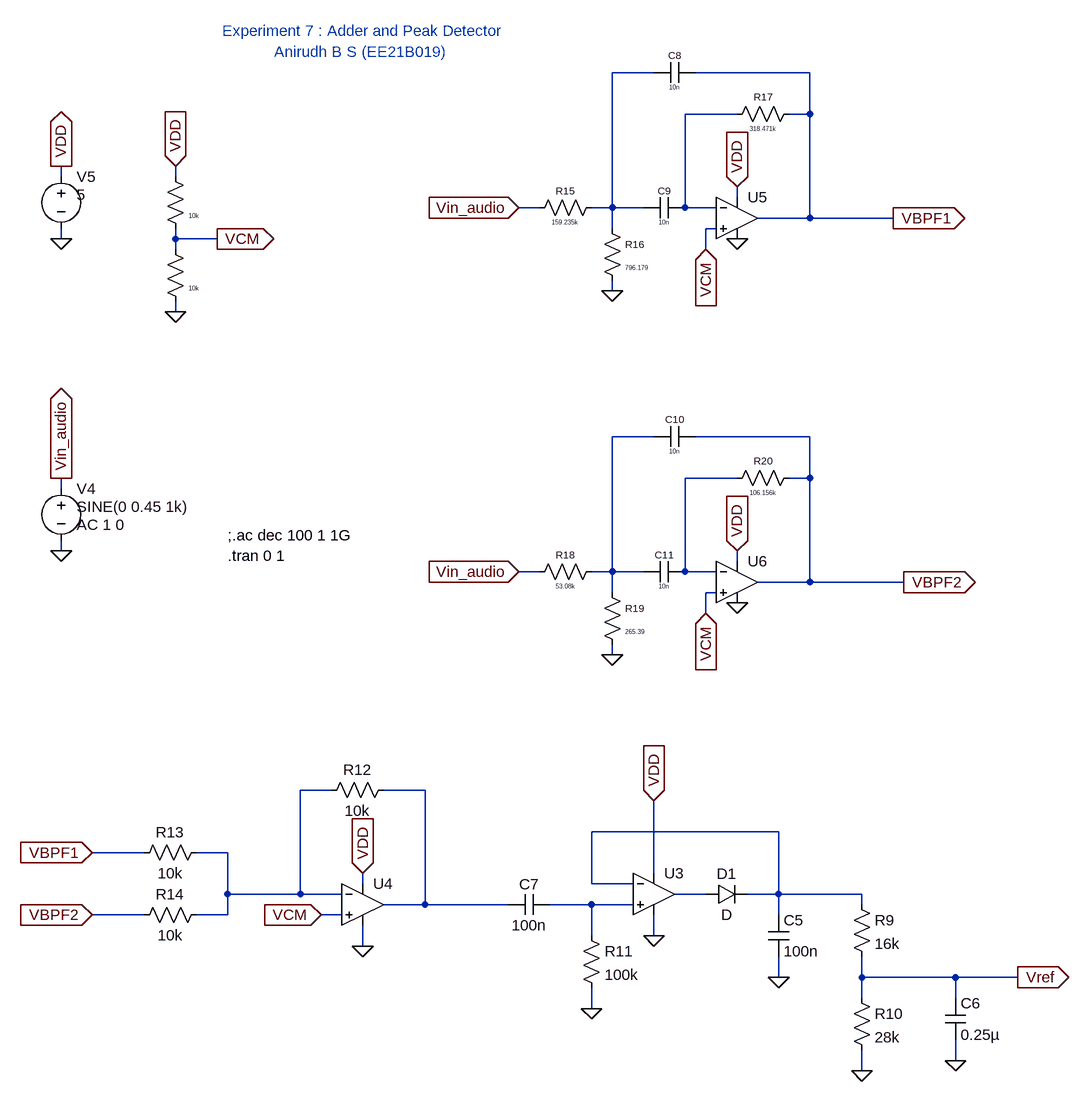
[diagram p0: schematic Experiment 7.asc]
Experiment 7.asc, the LTspice schematic file:
Version 4
SHEET 1 4812 1308
WIRE 4144 -576 4080 -576
WIRE 4384 -576 4208 -576
WIRE 4272 -512 4192 -512
WIRE 4384 -512 4384 -576
WIRE 4384 -512 4352 -512
WIRE 3232 -416 3232 -432
WIRE 3408 -416 3408 -432
WIRE 4272 -384 4272 -400
WIRE 3968 -368 3936 -368
WIRE 4080 -368 4080 -576
WIRE 4080 -368 4048 -368
WIRE 4128 -368 4080 -368
WIRE 4192 -368 4192 -512
WIRE 4240 -368 4192 -368
WIRE 4384 -352 4384 -512
WIRE 4384 -352 4304 -352
WIRE 4512 -352 4384 -352
WIRE 4080 -336 4080 -368
WIRE 4240 -336 4224 -336
WIRE 3232 -320 3232 -336
WIRE 3408 -320 3408 -336
WIRE 3472 -320 3408 -320
WIRE 3408 -304 3408 -320
WIRE 4224 -304 4224 -336
WIRE 4080 -240 4080 -256
WIRE 3408 -208 3408 -224
WIRE 4144 -16 4080 -16
WIRE 4384 -16 4208 -16
WIRE 4272 48 4192 48
WIRE 4384 48 4384 -16
WIRE 4384 48 4352 48
WIRE 3232 64 3232 48
WIRE 3232 160 3232 144
WIRE 4272 176 4272 160
WIRE 3968 192 3936 192
WIRE 4080 192 4080 -16
WIRE 4080 192 4048 192
WIRE 4128 192 4080 192
WIRE 4192 192 4192 48
WIRE 4240 192 4192 192
WIRE 4384 208 4384 48
WIRE 4384 208 4304 208
WIRE 4528 208 4384 208
WIRE 4080 224 4080 192
WIRE 4240 224 4224 224
WIRE 4224 256 4224 224
WIRE 4080 320 4080 304
WIRE 3648 528 3600 528
WIRE 3792 528 3728 528
WIRE 4336 592 4048 592
WIRE 3360 624 3280 624
WIRE 3488 624 3440 624
WIRE 4144 656 4144 544
WIRE 3696 672 3696 656
WIRE 4048 672 4048 592
WIRE 4112 672 4048 672
WIRE 3488 688 3488 624
WIRE 3600 688 3600 528
WIRE 3600 688 3488 688
WIRE 3664 688 3600 688
WIRE 4224 688 4176 688
WIRE 4336 688 4336 592
WIRE 4336 688 4288 688
WIRE 4464 688 4336 688
WIRE 3792 704 3792 528
WIRE 3792 704 3728 704
WIRE 3920 704 3792 704
WIRE 4048 704 3984 704
WIRE 4112 704 4048 704
WIRE 4464 704 4464 688
WIRE 3360 720 3280 720
WIRE 3488 720 3488 688
WIRE 3488 720 3440 720
WIRE 3664 720 3632 720
WIRE 4336 720 4336 688
WIRE 4048 752 4048 704
WIRE 4144 752 4144 720
WIRE 3696 768 3696 736
WIRE 4336 816 4336 784
WIRE 4464 816 4464 784
WIRE 4608 816 4464 816
WIRE 4704 816 4608 816
WIRE 4464 848 4464 816
WIRE 4608 848 4608 816
WIRE 4048 864 4048 832
WIRE 4608 944 4608 912
WIRE 4464 960 4464 928
FLAG 4144 752 0
FLAG 4144 544 VDD
IOPIN 4144 544 In
FLAG 4336 816 0
FLAG 4464 960 0
FLAG 4608 944 0
FLAG 4048 864 0
FLAG 3696 656 VDD
IOPIN 3696 656 In
FLAG 3696 768 0
FLAG 3632 720 VCM
IOPIN 3632 720 In
FLAG 3280 624 VBPF1
IOPIN 3280 624 In
FLAG 3280 720 VBPF2
IOPIN 3280 720 In
FLAG 4704 816 Vref
IOPIN 4704 816 Out
FLAG 4080 -240 0
FLAG 4272 -400 VDD
IOPIN 4272 -400 In
FLAG 3936 -368 Vin_audio
IOPIN 3936 -368 In
FLAG 3232 48 Vin_audio
IOPIN 3232 48 Out
FLAG 3232 160 0
FLAG 3232 -320 0
FLAG 3232 -432 VDD
IOPIN 3232 -432 Out
FLAG 4080 320 0
FLAG 4272 160 VDD
IOPIN 4272 160 In
FLAG 3936 192 Vin_audio
IOPIN 3936 192 In
FLAG 3408 -208 0
FLAG 3408 -432 VDD
IOPIN 3408 -432 In
FLAG 3472 -320 VCM
IOPIN 3472 -320 Out
FLAG 4224 -304 VCM
IOPIN 4224 -304 In
FLAG 4224 256 VCM
IOPIN 4224 256 In
FLAG 4528 208 VBPF2
IOPIN 4528 208 Out
FLAG 4512 -352 VBPF1
IOPIN 4512 -352 Out
FLAG 4272 -320 0
FLAG 4272 240 0
SYMBOL diode 4224 704 R270
WINDOW 0 32 32 VTop 2
WINDOW 3 0 32 VBottom 2
SYMATTR InstName D1
SYMBOL cap 4320 720 R0
SYMATTR InstName C5
SYMATTR Value 100n
SYMBOL res 4448 688 R0
SYMATTR InstName R9
SYMATTR Value 16k
SYMBOL res 4448 832 R0
SYMATTR InstName R10
SYMATTR Value 28k
SYMBOL cap 4592 848 R0
SYMATTR InstName C6
SYMATTR Value 0.25µ
SYMBOL OpAmps\\UniversalOpAmp2 4144 688 R0
SYMATTR InstName U3
SYMBOL OpAmps\\UniversalOpAmp 3696 704 R0
SYMATTR InstName U4
SYMBOL cap 3984 688 R90
WINDOW 0 0 32 VBottom 2
WINDOW 3 32 32 VTop 2
SYMATTR InstName C7
SYMATTR Value 100n
SYMBOL res 4032 736 R0
SYMATTR InstName R11
SYMATTR Value 100k
SYMBOL res 3744 512 R90
WINDOW 0 0 56 VBottom 2
WINDOW 3 32 56 VTop 2
SYMATTR InstName R12
SYMATTR Value 10k
SYMBOL res 3456 608 R90
WINDOW 0 0 56 VBottom 2
WINDOW 3 32 56 VTop 2
SYMATTR InstName R13
SYMATTR Value 10k
SYMBOL res 3456 704 R90
WINDOW 0 0 56 VBottom 2
WINDOW 3 32 56 VTop 2
SYMATTR InstName R14
SYMATTR Value 10k
SYMBOL res 4064 -384 R90
WINDOW 0 0 56 VBottom 1
WINDOW 3 32 56 VTop 0
SYMATTR InstName R15
SYMATTR Value 159.235k
SYMBOL res 4064 -352 R0
WINDOW 0 36 40 Left 1
WINDOW 3 36 76 Left 0
SYMATTR InstName R16
SYMATTR Value 796.179
SYMBOL res 4256 -496 R270
WINDOW 0 32 56 VTop 1
WINDOW 3 0 56 VBottom 0
SYMATTR InstName R17
SYMATTR Value 318.471k
SYMBOL cap 4208 -592 R90
WINDOW 0 0 32 VBottom 1
WINDOW 3 32 32 VTop 0
SYMATTR InstName C8
SYMATTR Value 10n
SYMBOL cap 4192 -384 R90
WINDOW 0 0 32 VBottom 1
WINDOW 3 32 32 VTop 0
SYMATTR InstName C9
SYMATTR Value 10n
SYMBOL voltage 3232 48 R0
WINDOW 3 24 44 Left 2
WINDOW 123 24 72 Left 2
SYMATTR Value SINE(0 0.45 1k)
SYMATTR Value2 AC 1 0
SYMATTR InstName V4
SYMBOL voltage 3232 -432 R0
WINDOW 3 24 44 Left 2
SYMATTR Value 5
SYMATTR InstName V5
SYMBOL res 4064 176 R90
WINDOW 0 0 56 VBottom 1
WINDOW 3 32 56 VTop 0
SYMATTR InstName R18
SYMATTR Value 53.08k
SYMBOL res 4064 208 R0
WINDOW 0 36 40 Left 1
WINDOW 3 36 76 Left 0
SYMATTR InstName R19
SYMATTR Value 265.39
SYMBOL res 4256 64 R270
WINDOW 0 32 56 VTop 1
WINDOW 3 0 56 VBottom 0
SYMATTR InstName R20
SYMATTR Value 106.156k
SYMBOL cap 4208 -32 R90
WINDOW 0 0 32 VBottom 1
WINDOW 3 32 32 VTop 0
SYMATTR InstName C10
SYMATTR Value 10n
SYMBOL cap 4192 176 R90
WINDOW 0 0 32 VBottom 1
WINDOW 3 32 32 VTop 0
SYMATTR InstName C11
SYMATTR Value 10n
SYMBOL res 3392 -432 R0
WINDOW 0 36 40 Invisible 2
WINDOW 3 36 76 Left 0
SYMATTR InstName R21
SYMATTR Value 10k
SYMBOL res 3392 -320 R0
WINDOW 0 36 40 Invisible 2
WINDOW 3 36 76 Left 0
SYMATTR InstName R22
SYMATTR Value 10k
SYMBOL OpAmps\\UniversalOpAmp 4272 -352 R0
SYMATTR InstName U5
SYMBOL OpAmps\\UniversalOpAmp 4272 208 R0
SYMATTR InstName U6
TEXT 3488 136 Left 2 !;.ac dec 100 1 1G\n.tran 0 1
TEXT 3560 -608 Left 2 ;Anirudh B S (EE21B019)
TEXT 3480 -640 Left 2 ;Experiment 7 : Adder and Peak Detector

The netlist it stands for:
* Experiment 7.asc
D1 N008 N007 D
C5 N007 0 100n
R9 N007 Vref 16k
R10 Vref 0 28k
C6 Vref 0 0.25µ
XU3 N009 N007 VDD 0 N008 level2 Avol=1Meg GBW=10Meg Slew=10Meg Ilimit=25m Rail=0 Vos=0 En=0 Enk=0 In=0 Ink=0 Rin=500Meg  ; pins In+ In- V+ V- OUT
XU4 VCM N005 VDD 0 N006 level1 Avol=1Meg GBW=10Meg Vos=0 En=0 Enk=0 In=0 Ink=0 Rin=500Meg  ; pins In+ In- V+ V- OUT
C7 N009 N006 100n
R11 N009 0 100k
R12 N006 N005 10k
R13 N005 VBPF1 10k
R14 N005 VBPF2 10k
R15 N001 Vin_audio 159.235k
R16 N001 0 796.179
R17 N002 VBPF1 318.471k
C8 VBPF1 N001 10n
C9 N002 N001 10n
V4 Vin_audio 0 SINE(0 0.45 1k) AC 1 0
V5 VDD 0 5
R18 N003 Vin_audio 53.08k
R19 N003 0 265.39
R20 N004 VBPF2 106.156k
C10 VBPF2 N003 10n
C11 N004 N003 10n
R21 VDD VCM 10k
R22 VCM 0 10k
XU5 VCM N002 VDD 0 VBPF1 level1 Avol=1Meg GBW=10Meg Vos=0 En=0 Enk=0 In=0 Ink=0 Rin=500Meg  ; pins In+ In- V+ V- OUT
XU6 VCM N004 VDD 0 VBPF2 level1 Avol=1Meg GBW=10Meg Vos=0 En=0 Enk=0 In=0 Ink=0 Rin=500Meg  ; pins In+ In- V+ V- OUT
.model D D
.lib standard.dio
;.ac dec 100 1 1G
.tran 0 1
* Anirudh B S (EE21B019)
* Experiment 7 : Adder and Peak Detector
.lib UniversalOpAmp2.lib
.lib UniversalOpAmp1.lib
.backanno
.end